# EAGLE schematic rtc (EAGLE 6.1)
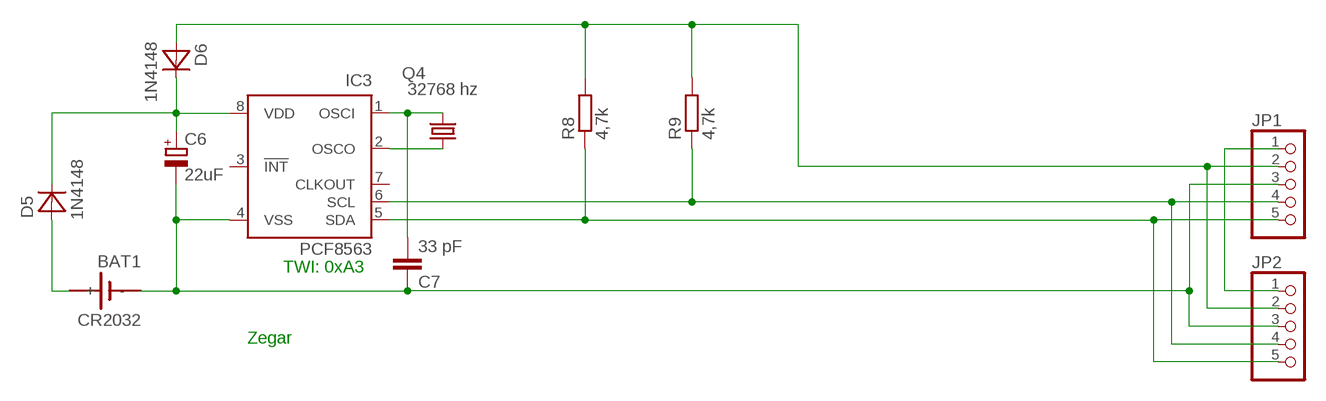
[diagram p0: schematic, sheet 1]

## Parts
BAT1  CR2032  SN2032LISPOL  [SN2932_LISPOL]
C6  22uF  CPOL-EUE2.5-5  [E2,5-5]
C7  33 pF  C-EU050-024X044  [C050-024X044]
D5  1N4148  [DO35-7]
D6  1N4148  [DO35-7]
IC3  PCF8563  [DIL08]
JP1  PINHD-1X5/90  [1X05/90]
JP2  PINHD-1X5/90  [1X05/90]
Q4  32768 hz  CRYSTALTC26V  [TC26V]
R8  4,7k  R-EU_R1206  [R1206]
R9  4,7k  R-EU_R1206  [R1206]

## Nets
+5V: D6.A JP1.2 JP2.2 R8.2 R9.2
+12V: JP1.1 JP2.1
GND: BAT1.- C6.- C7.1 IC3.4(VSS) JP1.3 JP2.3
N$4: IC3.2(OSCO) Q4.1
N$9 [power]: C7.2 IC3.1(OSCI) Q4.2
N$24: C6.+ D5.C D6.C IC3.8(VDD)
N$27: BAT1.+ D5.A
SCL: IC3.6(SCL) JP1.4 JP2.4 R9.1
SDA: IC3.5(SDA) JP1.5 JP2.5 R8.1
Unconnected: IC3.3(!INT) IC3.7(CLKOUT)

## Notes on the sheet
- TWI: 0xA3
- Zegar

## Library data of the parts
BAT1 = sn2032:SN2032: LI BATTERY
C6 = my_library:CPOL-EU: POLARIZED CAPACITOR, European symbol
C7 = my_library:C-EU: CAPACITOR, European symbol
D5 D6 = my_library:1N4148
IC3 = my_library:PCF8563: I2C-Bus CLOCK/CALENDAR
JP1 JP2 = pinhead:PINHD-1X5: PIN HEADER
Q4 = my_library:CRYSTAL: CRYSTAL
R8 R9 = rcl:R-EU_: RESISTOR, European symbol